# Altium schematic sheet JTAG批量下载板-V06.SchDoc
size A2
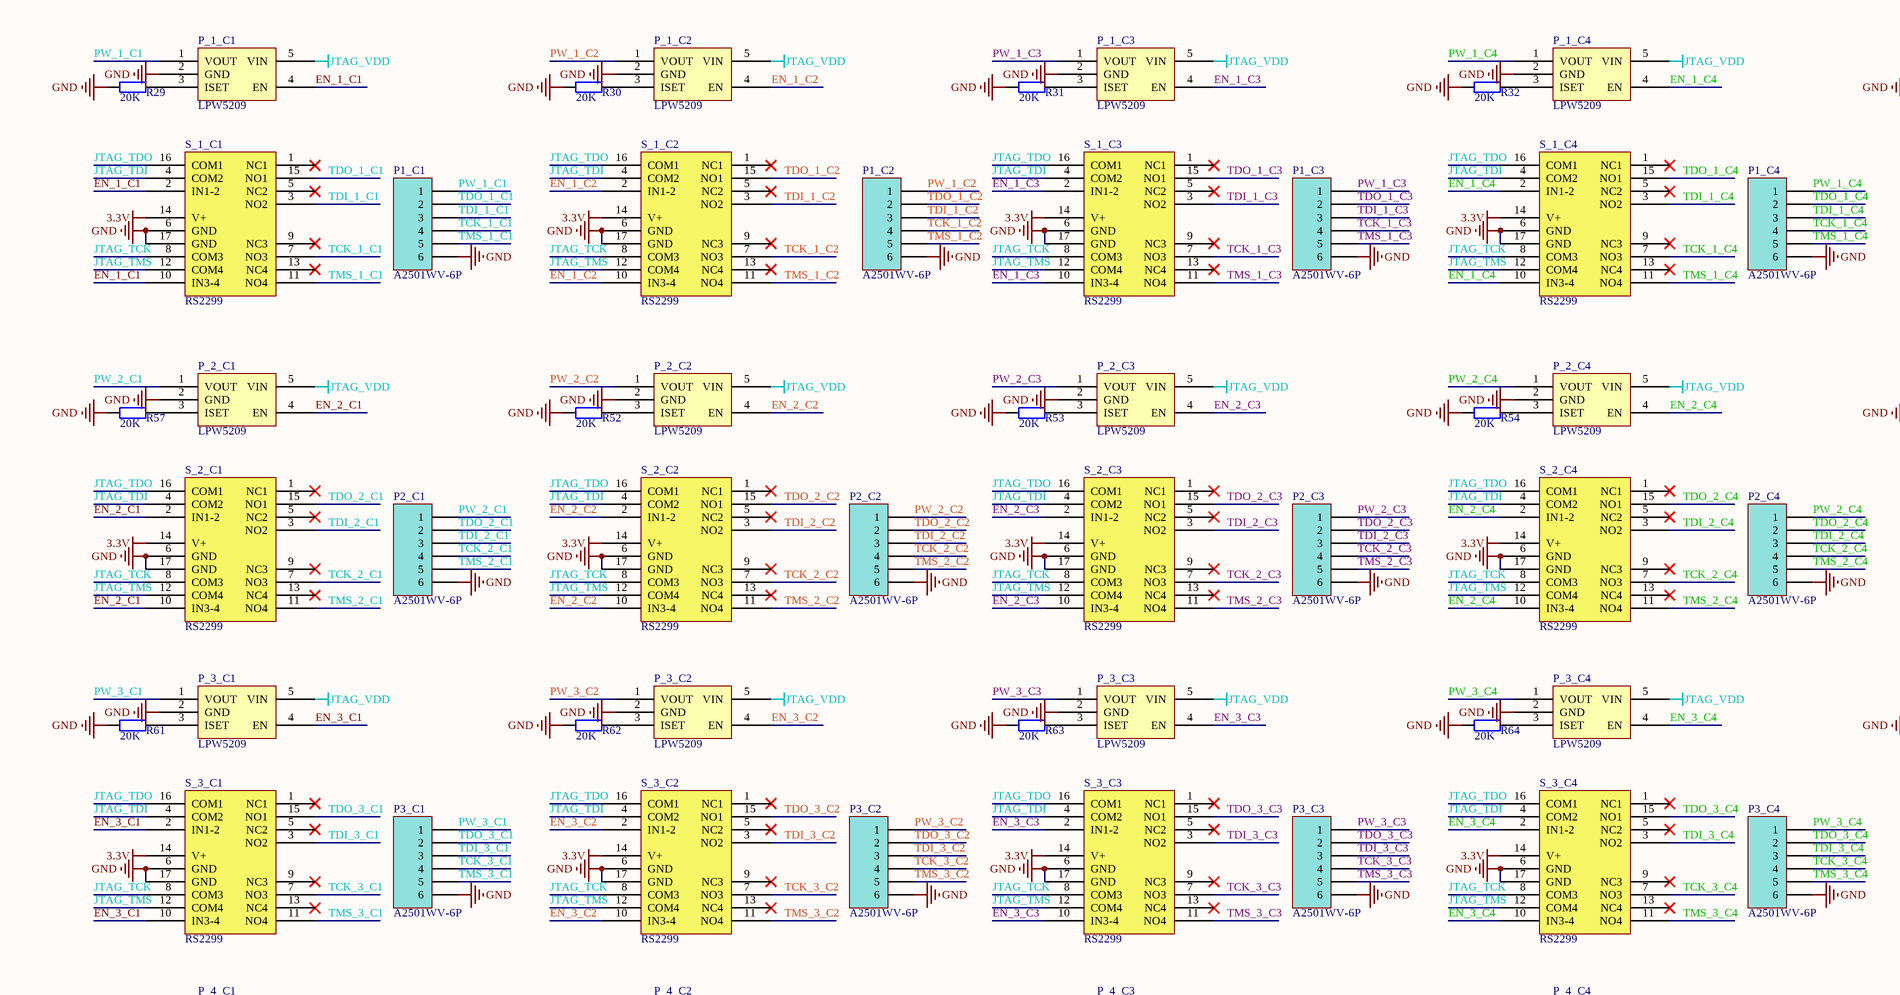
[diagram p0: JTAG批量下载板-V06.SchDoc, top left]
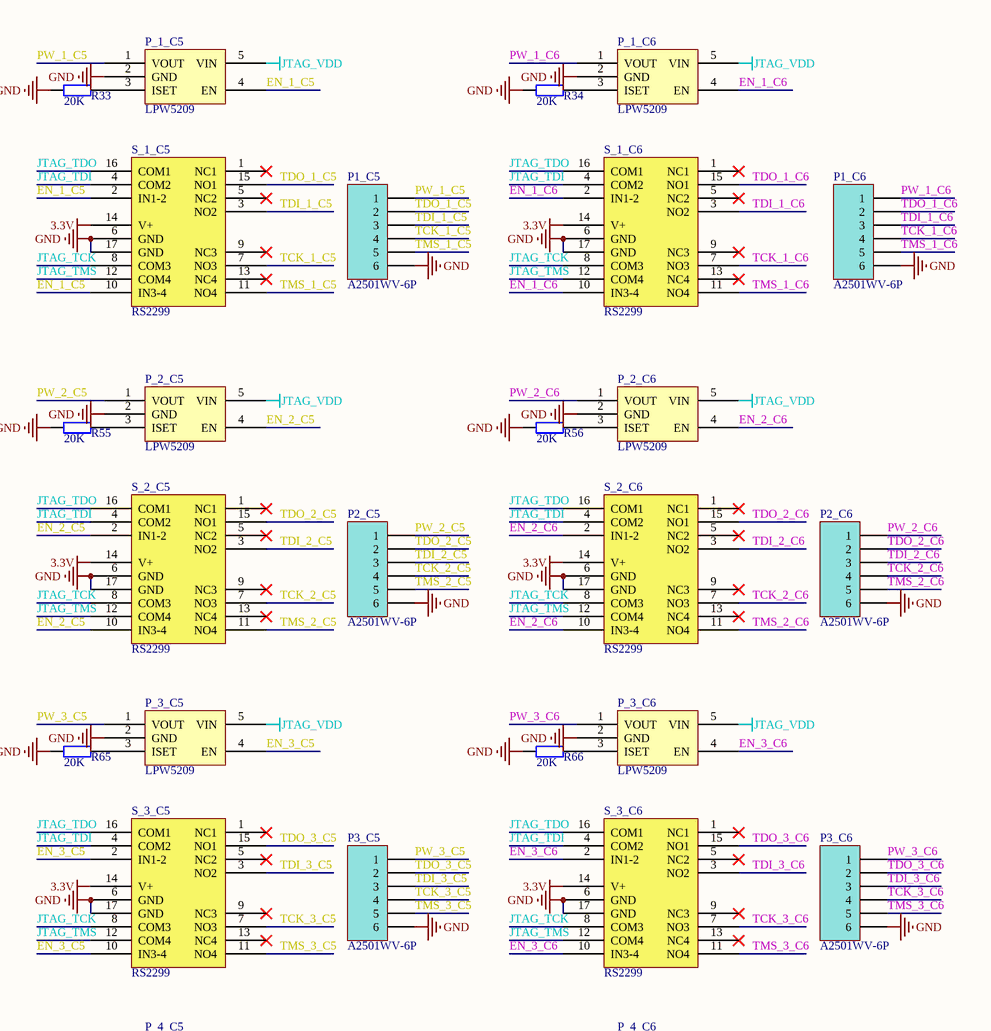
[diagram p1: JTAG批量下载板-V06.SchDoc, top right]
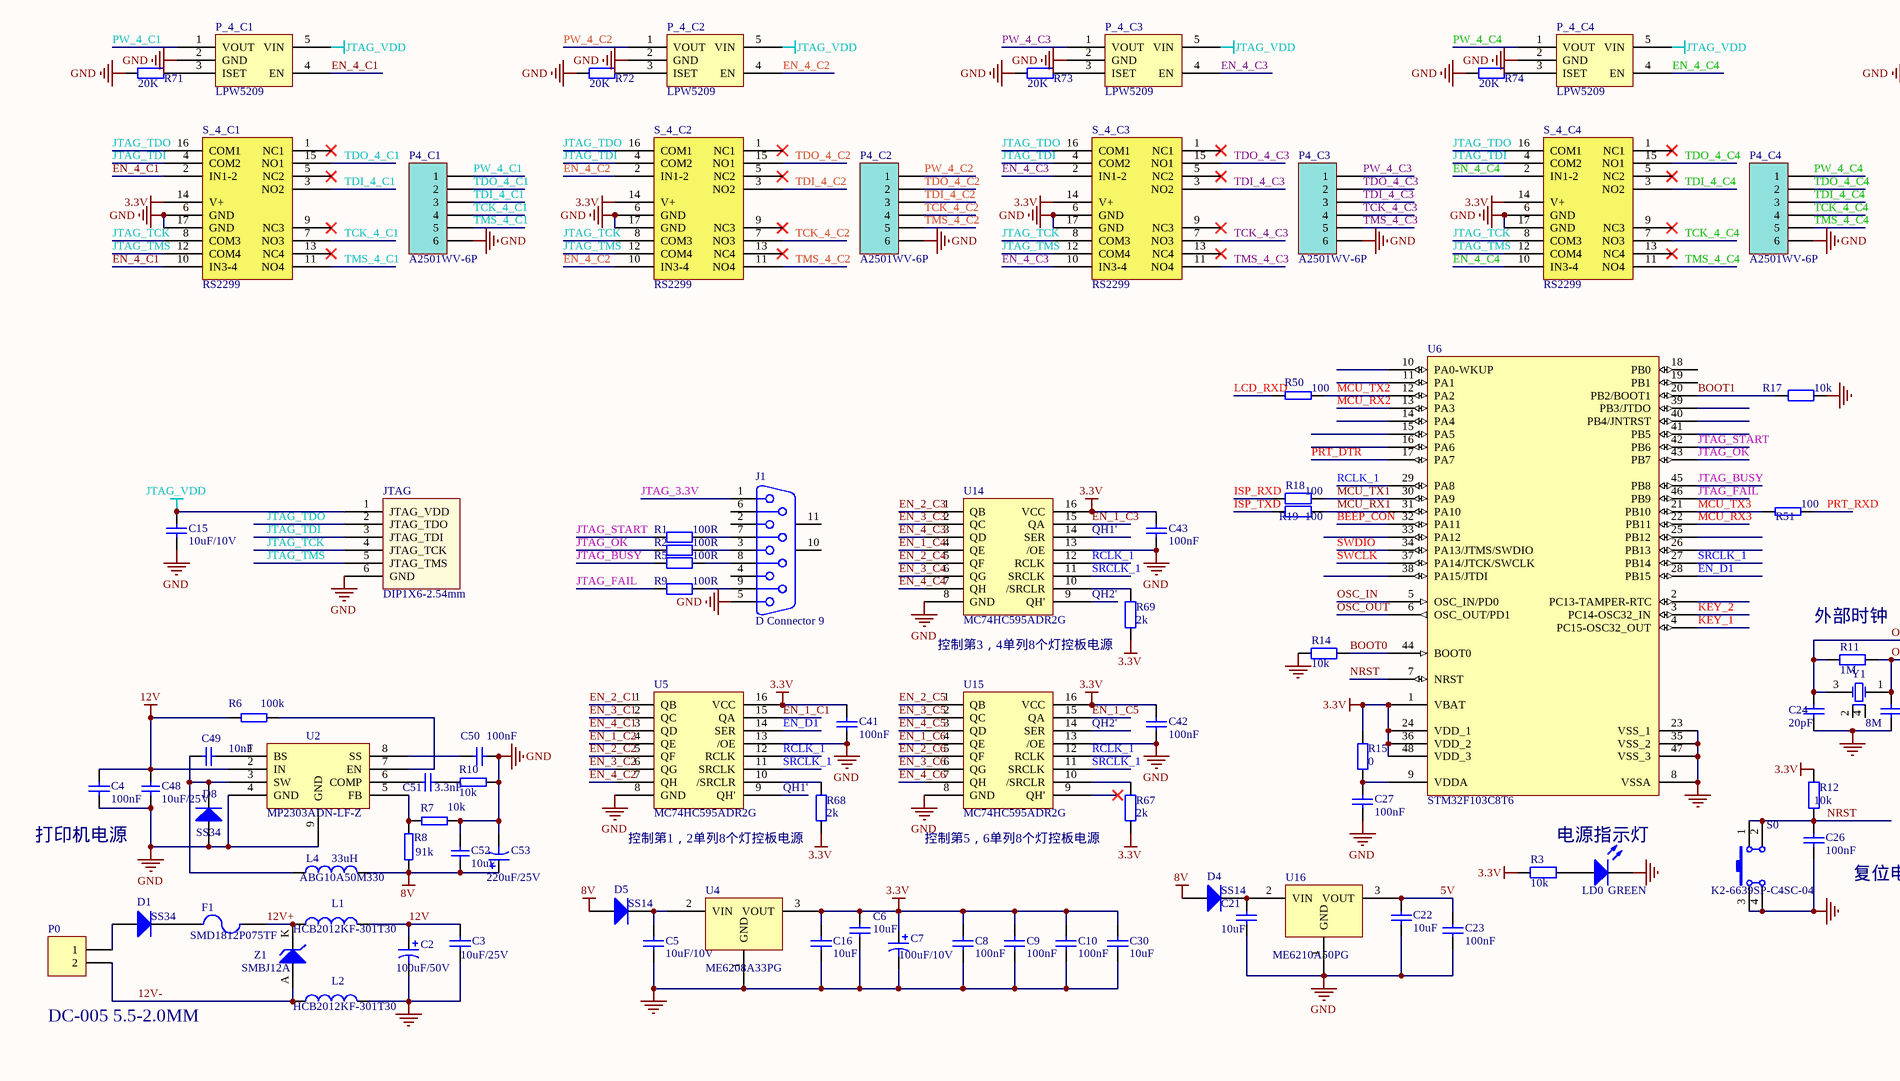
[diagram p2: JTAG批量下载板-V06.SchDoc, bottom left]
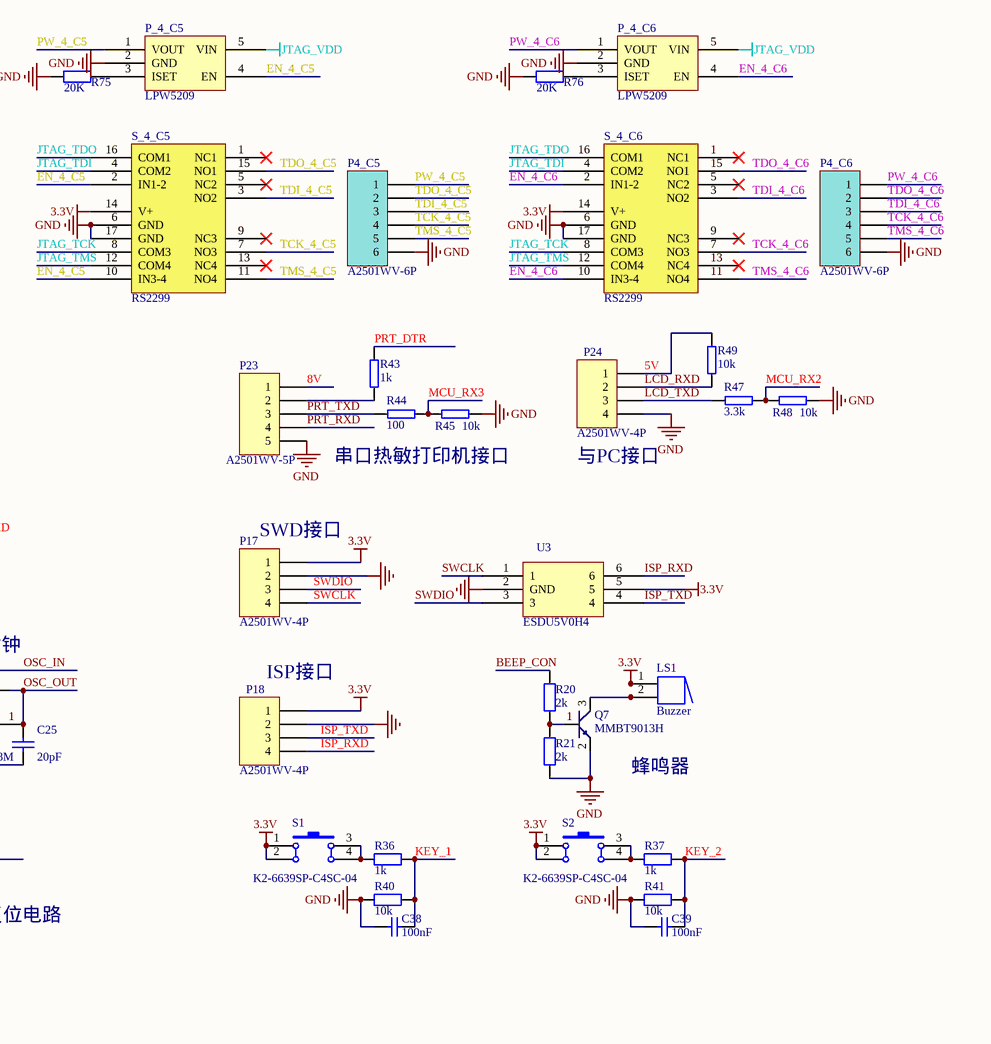
[diagram p3: JTAG批量下载板-V06.SchDoc, bottom right]

## Parts
C2  100uF/50V  [RB-6*9]
C3  10uF/25V  [C0805]
C4  100nF  [C0603]
C5  10uF/10V  [C0603]
C6  10uF  [C0603]
C7  100uF/10V  [C3528]
C8  100nF  [C0603]
C9  100nF  [C0603]
C10  100nF  [C0603]
C15  10uF/10V  [C0603]
C16  10uF  [C0603]
C21  10uF  [C0603]
C22  10uF  [C0603]
C23  100nF  [C0603]
C24  20pF  [C0603]
C25  20pF  [C0603]
C26  100nF  [C0603]
C27  100nF  [C0603]
C30  10uF  [C0603]
C38  100nF  [C0603]
C39  100nF  [C0603]
C41  100nF  [C0603]
C42  100nF  [C0603]
C43  100nF  [C0603]
C48  10uF/25V  [C0805]
C49  10nF  [C0603]
C50  100nF  [C0603]
C51  3.3nF  [C0603]
C52  10uF  [C0603]
C53  220uF/25V  [RB-6*9]
D1  SS34  [SMB]
D4  SS14  [SOD-123F]
D5  SS14  [SOD-123F]
D8  SS34  [SMB]
F1  SMD1812P075TF  [1812]
J1  D Connector 9  [DSUB1.385-2H9]
JTAG  DIP1X6-2.54mm  [XH2.5-6P]
L1  HCB2012KF-301T30  [R0805]
L2  HCB2012KF-301T30  [R0805]
L4  33uH  value ABG10A50M330  [L1040]
LD0  GREEN  [LED-0603]
LS1  Buzzer  [BUZZER-small]
P0  DC-005 5.5-2.0MM  [DC-005A]
P1_C1  A2501WV-6P  [XH2.5-6P]
P1_C2  A2501WV-6P  [XH2.5-6P]
P1_C3  A2501WV-6P  [XH2.5-6P]
P1_C4  A2501WV-6P  [XH2.5-6P]
P1_C5  A2501WV-6P  [XH2.5-6P]
P1_C6  A2501WV-6P  [XH2.5-6P]
P2_C1  A2501WV-6P  [XH2.5-6P]
P2_C2  A2501WV-6P  [XH2.5-6P]
P2_C3  A2501WV-6P  [XH2.5-6P]
P2_C4  A2501WV-6P  [XH2.5-6P]
P2_C5  A2501WV-6P  [XH2.5-6P]
P2_C6  A2501WV-6P  [XH2.5-6P]
P3_C1  A2501WV-6P  [XH2.5-6P]
P3_C2  A2501WV-6P  [XH2.5-6P]
P3_C3  A2501WV-6P  [XH2.5-6P]
P3_C4  A2501WV-6P  [XH2.5-6P]
P3_C5  A2501WV-6P  [XH2.5-6P]
P3_C6  A2501WV-6P  [XH2.5-6P]
P4_C1  A2501WV-6P  [XH2.5-6P]
P4_C2  A2501WV-6P  [XH2.5-6P]
P4_C3  A2501WV-6P  [XH2.5-6P]
P4_C4  A2501WV-6P  [XH2.5-6P]
P4_C5  A2501WV-6P  [XH2.5-6P]
P4_C6  A2501WV-6P  [XH2.5-6P]
P17  A2501WV-4P  [XH2.5-4P]
P18  A2501WV-4P  [XH2.5-4P]
P23  A2501WV-5P  [XH2.5-5P]
P24  A2501WV-4P  [XH2.5-4P]
P_1_C1  LPW5209  [SOT-23-5]
P_1_C2  LPW5209  [SOT-23-5]
P_1_C3  LPW5209  [SOT-23-5]
P_1_C4  LPW5209  [SOT-23-5]
P_1_C5  LPW5209  [SOT-23-5]
P_1_C6  LPW5209  [SOT-23-5]
P_2_C1  LPW5209  [SOT-23-5]
P_2_C2  LPW5209  [SOT-23-5]
P_2_C3  LPW5209  [SOT-23-5]
P_2_C4  LPW5209  [SOT-23-5]
P_2_C5  LPW5209  [SOT-23-5]
P_2_C6  LPW5209  [SOT-23-5]
P_3_C1  LPW5209  [SOT-23-5]
P_3_C2  LPW5209  [SOT-23-5]
P_3_C3  LPW5209  [SOT-23-5]
P_3_C4  LPW5209  [SOT-23-5]
P_3_C5  LPW5209  [SOT-23-5]
P_3_C6  LPW5209  [SOT-23-5]
P_4_C1  LPW5209  [SOT-23-5]
P_4_C2  LPW5209  [SOT-23-5]
P_4_C3  LPW5209  [SOT-23-5]
P_4_C4  LPW5209  [SOT-23-5]
P_4_C5  LPW5209  [SOT-23-5]
P_4_C6  LPW5209  [SOT-23-5]
Q7  MMBT9013H  [SOT-23]
R1  100R  [R0603]
R2  100R  [R0603]
R3  10k  [R0603]
R5  100R  [R0603]
R6  100k  [R0603]
R7  10k  [R0603]
R8  91k  [R0603]
R9  100R  [R0603]
R10  10k  [R0603]
R11  1M  [R0603]
R12  10k  [R0603]
R14  10k  [R0603]
R15  0  [R0603]
R17  10k  [R0603]
R18  100  [R0603]
R19  100  [R0603]
R20  2k  [R0603]
R21  2k  [R0603]
R29  20K  [R0603]
R30  20K  [R0603]
R31  20K  [R0603]
R32  20K  [R0603]
R33  20K  [R0603]
R34  20K  [R0603]
R36  1k  [R0603]
R37  1k  [R0603]
R40  10k  [R0603]
R41  10k  [R0603]
R43  1k  [R0603]
R44  100  [R0603]
R45  10k  [R0603]
R47  3.3k  [R0603]
R48  10k  [R0603]
R49  10k  [R0603]
R50  100  [R0603]
R51  100  [R0603]
R52  20K  [R0603]
R53  20K  [R0603]
R54  20K  [R0603]
R55  20K  [R0603]
R56  20K  [R0603]
R57  20K  [R0603]
R61  20K  [R0603]
R62  20K  [R0603]
R63  20K  [R0603]
R64  20K  [R0603]
R65  20K  [R0603]
R66  20K  [R0603]
R67  2k  [R0603]
R68  2k  [R0603]
R69  2k  [R0603]
R71  20K  [R0603]
R72  20K  [R0603]
R73  20K  [R0603]
R74  20K  [R0603]
R75  20K  [R0603]
R76  20K  [R0603]
S0  K2-6639SP-C4SC-04  [MY_KEYSOP4]
S1  K2-6639SP-C4SC-04  [MY_KEYSOP4]
S2  K2-6639SP-C4SC-04  [MY_KEYSOP4]
S_1_C1  RS2299  [QFN16]
S_1_C2  RS2299  [QFN16]
S_1_C3  RS2299  [QFN16]
S_1_C4  RS2299  [QFN16]
S_1_C5  RS2299  [QFN16]
S_1_C6  RS2299  [QFN16]
S_2_C1  RS2299  [QFN16]
S_2_C2  RS2299  [QFN16]
S_2_C3  RS2299  [QFN16]
S_2_C4  RS2299  [QFN16]
S_2_C5  RS2299  [QFN16]
S_2_C6  RS2299  [QFN16]
S_3_C1  RS2299  [QFN16]
S_3_C2  RS2299  [QFN16]
S_3_C3  RS2299  [QFN16]
S_3_C4  RS2299  [QFN16]
S_3_C5  RS2299  [QFN16]
S_3_C6  RS2299  [QFN16]
S_4_C1  RS2299  [QFN16]
S_4_C2  RS2299  [QFN16]
S_4_C3  RS2299  [QFN16]
S_4_C4  RS2299  [QFN16]
S_4_C5  RS2299  [QFN16]
S_4_C6  RS2299  [QFN16]
U2  MP2303ADN-LF-Z  [SO-8-EP]
U3  ESDU5V0H4  [SOT-23-6]
U4  ME6208A33PG  [SOT89N]
U5  MC74HC595ADR2G  [SOP16_M]
U6  STM32F103C8T6  [LQFP-48-1]
U14  MC74HC595ADR2G  [SOP16_M]
U15  MC74HC595ADR2G  [SOP16_M]
U16  ME6210A50PG  [SOT89N]
Y1  8M  [CRYSTAL_3.2*2.5]
Z1  SMBJ12A  [SMB]

## Nets
3.3V: C6.1 C7.1 C8.1 C9.1 C10.1 C16.1 C30.1 C41.1 C42.1 C43.1 LS1.1 P17.1 P18.1 R3.1 R12.2 R15.2 R67.1 R68.1 R69.1 S1.1 S1.2 S2.1 S2.2 S_1_C1.14(V+) S_1_C2.14(V+) S_1_C3.14(V+) S_1_C4.14(V+) S_1_C5.14(V+) S_1_C6.14(V+) S_2_C1.14(V+) S_2_C2.14(V+) S_2_C3.14(V+) S_2_C4.14(V+) S_2_C5.14(V+) S_2_C6.14(V+) S_3_C1.14(V+) S_3_C2.14(V+) S_3_C3.14(V+) S_3_C4.14(V+) S_3_C5.14(V+) S_3_C6.14(V+) S_4_C1.14(V+) S_4_C2.14(V+) S_4_C3.14(V+) S_4_C4.14(V+) S_4_C5.14(V+) S_4_C6.14(V+) U3.5 U4.3(VOUT) U5.16(VCC) U6.1(VBAT) U6.24(VDD_1) U6.36(VDD_2) U6.48(VDD_3) U14.16(VCC) U15.16(VCC)
8V: C52.1 C53.1 D4.1(A) D5.1(A) L4.2 P23.1 R8.2
12V: C2.1 C3.1 C4.1 C48.1 L1.1 R6.2 U2.2(IN)
GND: C2.2 C3.2 C4.2 C5.2 C6.2 C7.2 C8.2 C9.2 C10.2 C15.2 C16.2 C21.2 C22.2 C23.1 C24.2 C25.2 C26.2 C27.2 C30.2 C38.1 C39.1 C41.2 C42.2 C43.2 C48.2 C50.2 C52.2 C53.2 D8.1(A) J1.5 JTAG.6(GND) L2.1 LD0.2(K) P1_C1.6 P1_C2.6 P1_C3.6 P1_C4.6 P1_C5.6 P1_C6.6 P2_C1.6 P2_C2.6 P2_C3.6 P2_C4.6 P2_C5.6 P2_C6.6 P3_C1.6 P3_C2.6 P3_C3.6 P3_C4.6 P3_C5.6 P3_C6.6 P4_C1.6 P4_C2.6 P4_C3.6 P4_C4.6 P4_C5.6 P4_C6.6 P17.2 P18.2 P23.5 P24.4 P_1_C1.2(GND) P_1_C2.2(GND) P_1_C3.2(GND) P_1_C4.2(GND) P_1_C5.2(GND) P_1_C6.2(GND) P_2_C1.2(GND) P_2_C2.2(GND) P_2_C3.2(GND) P_2_C4.2(GND) P_2_C5.2(GND) P_2_C6.2(GND) P_3_C1.2(GND) P_3_C2.2(GND) P_3_C3.2(GND) P_3_C4.2(GND) P_3_C5.2(GND) P_3_C6.2(GND) P_4_C1.2(GND) P_4_C2.2(GND) P_4_C3.2(GND) P_4_C4.2(GND) P_4_C5.2(GND) P_4_C6.2(GND) Q7.2(E) R7.1 R10.1 R14.1 R17.1 R21.1 R29.2 R30.2 R31.2 R32.2 R33.2 R34.2 R40.2 R41.2 R45.1 R48.1 R52.2 R53.2 R54.2 R55.2 R56.2 R57.2 R61.2 R62.2 R63.2 R64.2 R65.2 R66.2 R71.2 R72.2 R73.2 R74.2 R75.2 R76.2 S0.3 S0.4 S_1_C1.6(GND) S_1_C1.17(GND) S_1_C2.6(GND) S_1_C2.17(GND) S_1_C3.6(GND) S_1_C3.17(GND) S_1_C4.6(GND) S_1_C4.17(GND) S_1_C5.6(GND) S_1_C5.17(GND) S_1_C6.6(GND) S_1_C6.17(GND) S_2_C1.6(GND) S_2_C1.17(GND) S_2_C2.6(GND) S_2_C2.17(GND) S_2_C3.6(GND) S_2_C3.17(GND) S_2_C4.6(GND) S_2_C4.17(GND) S_2_C5.6(GND) S_2_C5.17(GND) S_2_C6.6(GND) S_2_C6.17(GND) S_3_C1.6(GND) S_3_C1.17(GND) S_3_C2.6(GND) S_3_C2.17(GND) S_3_C3.6(GND) S_3_C3.17(GND) S_3_C4.6(GND) S_3_C4.17(GND) S_3_C5.6(GND) S_3_C5.17(GND) S_3_C6.6(GND) S_3_C6.17(GND) S_4_C1.6(GND) S_4_C1.17(GND) S_4_C2.6(GND) S_4_C2.17(GND) S_4_C3.6(GND) S_4_C3.17(GND) S_4_C4.6(GND) S_4_C4.17(GND) S_4_C5.6(GND) S_4_C5.17(GND) S_4_C6.6(GND) S_4_C6.17(GND) U2.4(GND) U2.9(GND) U3.2(GND) U4.1(GND) U5.8(GND) U5.13(/OE) U6.8(VSSA) U6.23(VSS_1) U6.35(VSS_2) U6.47(VSS_3) U14.8(GND) U14.13(/OE) U15.8(GND) U15.13(/OE) U16.1(GND)
JTAG_VDD: C15.1 JTAG.1(JTAG_VDD) P_1_C1.5(VIN) P_1_C2.5(VIN) P_1_C3.5(VIN) P_1_C4.5(VIN) P_1_C5.5(VIN) P_1_C6.5(VIN) P_2_C1.5(VIN) P_2_C2.5(VIN) P_2_C3.5(VIN) P_2_C4.5(VIN) P_2_C5.5(VIN) P_2_C6.5(VIN) P_3_C1.5(VIN) P_3_C2.5(VIN) P_3_C3.5(VIN) P_3_C4.5(VIN) P_3_C5.5(VIN) P_3_C6.5(VIN) P_4_C1.5(VIN) P_4_C2.5(VIN) P_4_C3.5(VIN) P_4_C4.5(VIN) P_4_C5.5(VIN) P_4_C6.5(VIN)
5V: C22.1 C23.2 P24.1 R49.2 U16.3(VOUT)
12V+: F1.2 L1.2 Z1.K
12V-: L2.2 P0.2 Z1.A
BEEP_CON: R20.1 U6.32(PA11)
BOOT0: R14.2 U6.44(BOOT0)
BOOT1: R17.2 U6.20(PB2/BOOT1)
EN_1_C1: P_1_C1.4(EN) S_1_C1.2(IN1-2) S_1_C1.10(IN3-4) U5.15(QA)
EN_1_C2: P_1_C2.4(EN) S_1_C2.2(IN1-2) S_1_C2.10(IN3-4) U5.4(QE)
EN_1_C3: P_1_C3.4(EN) S_1_C3.2(IN1-2) S_1_C3.10(IN3-4) U14.15(QA)
EN_1_C4: P_1_C4.4(EN) S_1_C4.2(IN1-2) S_1_C4.10(IN3-4) U14.4(QE)
EN_1_C5: P_1_C5.4(EN) S_1_C5.2(IN1-2) S_1_C5.10(IN3-4) U15.15(QA)
EN_1_C6: P_1_C6.4(EN) S_1_C6.2(IN1-2) S_1_C6.10(IN3-4) U15.4(QE)
EN_2_C1: P_2_C1.4(EN) S_2_C1.2(IN1-2) S_2_C1.10(IN3-4) U5.1(QB)
EN_2_C2: P_2_C2.4(EN) S_2_C2.2(IN1-2) S_2_C2.10(IN3-4) U5.5(QF)
EN_2_C3: P_2_C3.4(EN) S_2_C3.2(IN1-2) S_2_C3.10(IN3-4) U14.1(QB)
EN_2_C4: P_2_C4.4(EN) S_2_C4.2(IN1-2) S_2_C4.10(IN3-4) U14.5(QF)
EN_2_C5: P_2_C5.4(EN) S_2_C5.2(IN1-2) S_2_C5.10(IN3-4) U15.1(QB)
EN_2_C6: P_2_C6.4(EN) S_2_C6.2(IN1-2) S_2_C6.10(IN3-4) U15.5(QF)
EN_3_C1: P_3_C1.4(EN) S_3_C1.2(IN1-2) S_3_C1.10(IN3-4) U5.2(QC)
EN_3_C2: P_3_C2.4(EN) S_3_C2.2(IN1-2) S_3_C2.10(IN3-4) U5.6(QG)
EN_3_C3: P_3_C3.4(EN) S_3_C3.2(IN1-2) S_3_C3.10(IN3-4) U14.2(QC)
EN_3_C4: P_3_C4.4(EN) S_3_C4.2(IN1-2) S_3_C4.10(IN3-4) U14.6(QG)
EN_3_C5: P_3_C5.4(EN) S_3_C5.2(IN1-2) S_3_C5.10(IN3-4) U15.2(QC)
EN_3_C6: P_3_C6.4(EN) S_3_C6.2(IN1-2) S_3_C6.10(IN3-4) U15.6(QG)
EN_4_C1: P_4_C1.4(EN) S_4_C1.2(IN1-2) S_4_C1.10(IN3-4) U5.3(QD)
EN_4_C2: P_4_C2.4(EN) S_4_C2.2(IN1-2) S_4_C2.10(IN3-4) U5.7(QH)
EN_4_C3: P_4_C3.4(EN) S_4_C3.2(IN1-2) S_4_C3.10(IN3-4) U14.3(QD)
EN_4_C4: P_4_C4.4(EN) S_4_C4.2(IN1-2) S_4_C4.10(IN3-4) U14.7(QH)
EN_4_C5: P_4_C5.4(EN) S_4_C5.2(IN1-2) S_4_C5.10(IN3-4) U15.3(QD)
EN_4_C6: P_4_C6.4(EN) S_4_C6.2(IN1-2) S_4_C6.10(IN3-4) U15.7(QH)
EN_D1: U5.14(SER) U6.28(PB15)
ISP_RXD: P18.4 R18.1 U3.6
ISP_TXD: P18.3 R19.1 U3.4
JTAG_3.3V: J1.1
JTAG_BUSY: R5.2 U6.45(PB8)
JTAG_FAIL: R9.2 U6.46(PB9)
JTAG_OK: R2.2 U6.43(PB7)
JTAG_START: R1.2 U6.42(PB6)
JTAG_TCK: JTAG.4(JTAG_TCK) S_1_C1.8(COM3) S_1_C2.8(COM3) S_1_C3.8(COM3) S_1_C4.8(COM3) S_1_C5.8(COM3) S_1_C6.8(COM3) S_2_C1.8(COM3) S_2_C2.8(COM3) S_2_C3.8(COM3) S_2_C4.8(COM3) S_2_C5.8(COM3) S_2_C6.8(COM3) S_3_C1.8(COM3) S_3_C2.8(COM3) S_3_C3.8(COM3) S_3_C4.8(COM3) S_3_C5.8(COM3) S_3_C6.8(COM3) S_4_C1.8(COM3) S_4_C2.8(COM3) S_4_C3.8(COM3) S_4_C4.8(COM3) S_4_C5.8(COM3) S_4_C6.8(COM3)
JTAG_TDI: JTAG.3(JTAG_TDI) S_1_C1.4(COM2) S_1_C2.4(COM2) S_1_C3.4(COM2) S_1_C4.4(COM2) S_1_C5.4(COM2) S_1_C6.4(COM2) S_2_C1.4(COM2) S_2_C2.4(COM2) S_2_C3.4(COM2) S_2_C4.4(COM2) S_2_C5.4(COM2) S_2_C6.4(COM2) S_3_C1.4(COM2) S_3_C2.4(COM2) S_3_C3.4(COM2) S_3_C4.4(COM2) S_3_C5.4(COM2) S_3_C6.4(COM2) S_4_C1.4(COM2) S_4_C2.4(COM2) S_4_C3.4(COM2) S_4_C4.4(COM2) S_4_C5.4(COM2) S_4_C6.4(COM2)
JTAG_TDO: JTAG.2(JTAG_TDO) S_1_C1.16(COM1) S_1_C2.16(COM1) S_1_C3.16(COM1) S_1_C4.16(COM1) S_1_C5.16(COM1) S_1_C6.16(COM1) S_2_C1.16(COM1) S_2_C2.16(COM1) S_2_C3.16(COM1) S_2_C4.16(COM1) S_2_C5.16(COM1) S_2_C6.16(COM1) S_3_C1.16(COM1) S_3_C2.16(COM1) S_3_C3.16(COM1) S_3_C4.16(COM1) S_3_C5.16(COM1) S_3_C6.16(COM1) S_4_C1.16(COM1) S_4_C2.16(COM1) S_4_C3.16(COM1) S_4_C4.16(COM1) S_4_C5.16(COM1) S_4_C6.16(COM1)
JTAG_TMS: JTAG.5(JTAG_TMS) S_1_C1.12(COM4) S_1_C2.12(COM4) S_1_C3.12(COM4) S_1_C4.12(COM4) S_1_C5.12(COM4) S_1_C6.12(COM4) S_2_C1.12(COM4) S_2_C2.12(COM4) S_2_C3.12(COM4) S_2_C4.12(COM4) S_2_C5.12(COM4) S_2_C6.12(COM4) S_3_C1.12(COM4) S_3_C2.12(COM4) S_3_C3.12(COM4) S_3_C4.12(COM4) S_3_C5.12(COM4) S_3_C6.12(COM4) S_4_C1.12(COM4) S_4_C2.12(COM4) S_4_C3.12(COM4) S_4_C4.12(COM4) S_4_C5.12(COM4) S_4_C6.12(COM4)
KEY_1: C38.2 R36.1 R40.1 U6.4(PC15-OSC32_OUT)
KEY_2: C39.2 R37.1 R41.1 U6.3(PC14-OSC32_IN)
LCD_RXD: P24.2 R49.1 R50.1
LCD_TXD: P24.3 R47.1
MCU_RX1: R19.2 U6.31(PA10)
MCU_RX2: R47.2 R48.2 U6.13(PA3)
MCU_RX3: R44.2 R45.2 U6.22(PB11)
MCU_TX1: R18.2 U6.30(PA9)
MCU_TX2: R50.2 U6.12(PA2)
MCU_TX3: R51.2 U6.21(PB10)
NRST: C26.1 R12.1 S0.1 S0.2 U6.7(NRST)
OSC_IN: C24.1 R11.1 U6.5(OSC_IN/PD0) Y1.3(OUTPUT)
OSC_OUT: C25.1 R11.2 U6.6(OSC_OUT/PD1) Y1.1(INPUT)
PRT_DTR: R43.2 U6.17(PA7)
PRT_RXD: P23.4 R51.1
PRT_TXD: P23.3 R44.1
PW_1_C1: P1_C1.1 P_1_C1.1(VOUT)
PW_1_C2: P1_C2.1 P_1_C2.1(VOUT)
PW_1_C3: P1_C3.1 P_1_C3.1(VOUT)
PW_1_C4: P1_C4.1 P_1_C4.1(VOUT)
PW_1_C5: P1_C5.1 P_1_C5.1(VOUT)
PW_1_C6: P1_C6.1 P_1_C6.1(VOUT)
PW_2_C1: P2_C1.1 P_2_C1.1(VOUT)
PW_2_C2: P2_C2.1 P_2_C2.1(VOUT)
PW_2_C3: P2_C3.1 P_2_C3.1(VOUT)
PW_2_C4: P2_C4.1 P_2_C4.1(VOUT)
PW_2_C5: P2_C5.1 P_2_C5.1(VOUT)
PW_2_C6: P2_C6.1 P_2_C6.1(VOUT)
PW_3_C1: P3_C1.1 P_3_C1.1(VOUT)
PW_3_C2: P3_C2.1 P_3_C2.1(VOUT)
PW_3_C3: P3_C3.1 P_3_C3.1(VOUT)
PW_3_C4: P3_C4.1 P_3_C4.1(VOUT)
PW_3_C5: P3_C5.1 P_3_C5.1(VOUT)
PW_3_C6: P3_C6.1 P_3_C6.1(VOUT)
PW_4_C1: P4_C1.1 P_4_C1.1(VOUT)
PW_4_C2: P4_C2.1 P_4_C2.1(VOUT)
PW_4_C3: P4_C3.1 P_4_C3.1(VOUT)
PW_4_C4: P4_C4.1 P_4_C4.1(VOUT)
PW_4_C5: P4_C5.1 P_4_C5.1(VOUT)
PW_4_C6: P4_C6.1 P_4_C6.1(VOUT)
QH1': U5.9(QH') U14.14(SER)
QH2': U14.9(QH') U15.14(SER)
RCLK_1: U5.12(RCLK) U6.29(PA8) U14.12(RCLK) U15.12(RCLK)
SRCLK_1: U5.11(SRCLK) U6.27(PB14) U14.11(SRCLK) U15.11(SRCLK)
SWCLK: P17.4 U3.1 U6.37(PA14/JTCK/SWCLK)
SWDIO: P17.3 U3.3 U6.34(PA13/JTMS/SWDIO)
TCK_1_C1: P1_C1.4 S_1_C1.7(NO3)
TCK_1_C2: P1_C2.4 S_1_C2.7(NO3)
TCK_1_C3: P1_C3.4 S_1_C3.7(NO3)
TCK_1_C4: P1_C4.4 S_1_C4.7(NO3)
TCK_1_C5: P1_C5.4 S_1_C5.7(NO3)
TCK_1_C6: P1_C6.4 S_1_C6.7(NO3)
TCK_2_C1: P2_C1.4 S_2_C1.7(NO3)
TCK_2_C2: P2_C2.4 S_2_C2.7(NO3)
TCK_2_C3: P2_C3.4 S_2_C3.7(NO3)
TCK_2_C4: P2_C4.4 S_2_C4.7(NO3)
TCK_2_C5: P2_C5.4 S_2_C5.7(NO3)
TCK_2_C6: P2_C6.4 S_2_C6.7(NO3)
TCK_3_C1: P3_C1.4 S_3_C1.7(NO3)
TCK_3_C2: P3_C2.4 S_3_C2.7(NO3)
TCK_3_C3: P3_C3.4 S_3_C3.7(NO3)
TCK_3_C4: P3_C4.4 S_3_C4.7(NO3)
TCK_3_C5: P3_C5.4 S_3_C5.7(NO3)
TCK_3_C6: P3_C6.4 S_3_C6.7(NO3)
TCK_4_C1: P4_C1.4 S_4_C1.7(NO3)
TCK_4_C2: P4_C2.4 S_4_C2.7(NO3)
TCK_4_C3: P4_C3.4 S_4_C3.7(NO3)
TCK_4_C4: P4_C4.4 S_4_C4.7(NO3)
TCK_4_C5: P4_C5.4 S_4_C5.7(NO3)
TCK_4_C6: P4_C6.4 S_4_C6.7(NO3)
TDI_1_C1: P1_C1.3 S_1_C1.3(NO2)
TDI_1_C2: P1_C2.3 S_1_C2.3(NO2)
TDI_1_C3: P1_C3.3 S_1_C3.3(NO2)
TDI_1_C4: P1_C4.3 S_1_C4.3(NO2)
TDI_1_C5: P1_C5.3 S_1_C5.3(NO2)
TDI_1_C6: P1_C6.3 S_1_C6.3(NO2)
TDI_2_C1: P2_C1.3 S_2_C1.3(NO2)
TDI_2_C2: P2_C2.3 S_2_C2.3(NO2)
TDI_2_C3: P2_C3.3 S_2_C3.3(NO2)
TDI_2_C4: P2_C4.3 S_2_C4.3(NO2)
TDI_2_C5: P2_C5.3 S_2_C5.3(NO2)
TDI_2_C6: P2_C6.3 S_2_C6.3(NO2)
TDI_3_C1: P3_C1.3 S_3_C1.3(NO2)
TDI_3_C2: P3_C2.3 S_3_C2.3(NO2)
TDI_3_C3: P3_C3.3 S_3_C3.3(NO2)
TDI_3_C4: P3_C4.3 S_3_C4.3(NO2)
TDI_3_C5: P3_C5.3 S_3_C5.3(NO2)
TDI_3_C6: P3_C6.3 S_3_C6.3(NO2)
TDI_4_C1: P4_C1.3 S_4_C1.3(NO2)
TDI_4_C2: P4_C2.3 S_4_C2.3(NO2)
TDI_4_C3: P4_C3.3 S_4_C3.3(NO2)
TDI_4_C4: P4_C4.3 S_4_C4.3(NO2)
TDI_4_C5: P4_C5.3 S_4_C5.3(NO2)
TDI_4_C6: P4_C6.3 S_4_C6.3(NO2)
TDO_1_C1: P1_C1.2 S_1_C1.15(NO1)
TDO_1_C2: P1_C2.2 S_1_C2.15(NO1)
TDO_1_C3: P1_C3.2 S_1_C3.15(NO1)
TDO_1_C4: P1_C4.2 S_1_C4.15(NO1)
TDO_1_C5: P1_C5.2 S_1_C5.15(NO1)
TDO_1_C6: P1_C6.2 S_1_C6.15(NO1)
TDO_2_C1: P2_C1.2 S_2_C1.15(NO1)
TDO_2_C2: P2_C2.2 S_2_C2.15(NO1)
TDO_2_C3: P2_C3.2 S_2_C3.15(NO1)
TDO_2_C4: P2_C4.2 S_2_C4.15(NO1)
TDO_2_C5: P2_C5.2 S_2_C5.15(NO1)
TDO_2_C6: P2_C6.2 S_2_C6.15(NO1)
TDO_3_C1: P3_C1.2 S_3_C1.15(NO1)
TDO_3_C2: P3_C2.2 S_3_C2.15(NO1)
TDO_3_C3: P3_C3.2 S_3_C3.15(NO1)
TDO_3_C4: P3_C4.2 S_3_C4.15(NO1)
TDO_3_C5: P3_C5.2 S_3_C5.15(NO1)
TDO_3_C6: P3_C6.2 S_3_C6.15(NO1)
TDO_4_C1: P4_C1.2 S_4_C1.15(NO1)
TDO_4_C2: P4_C2.2 S_4_C2.15(NO1)
TDO_4_C3: P4_C3.2 S_4_C3.15(NO1)
TDO_4_C4: P4_C4.2 S_4_C4.15(NO1)
TDO_4_C5: P4_C5.2 S_4_C5.15(NO1)
TDO_4_C6: P4_C6.2 S_4_C6.15(NO1)
TMS_1_C1: P1_C1.5 S_1_C1.11(NO4)
TMS_1_C2: P1_C2.5 S_1_C2.11(NO4)
TMS_1_C3: P1_C3.5 S_1_C3.11(NO4)
TMS_1_C4: P1_C4.5 S_1_C4.11(NO4)
TMS_1_C5: P1_C5.5 S_1_C5.11(NO4)
TMS_1_C6: P1_C6.5 S_1_C6.11(NO4)
TMS_2_C1: P2_C1.5 S_2_C1.11(NO4)
TMS_2_C2: P2_C2.5 S_2_C2.11(NO4)
TMS_2_C3: P2_C3.5 S_2_C3.11(NO4)
TMS_2_C4: P2_C4.5 S_2_C4.11(NO4)
TMS_2_C5: P2_C5.5 S_2_C5.11(NO4)
TMS_2_C6: P2_C6.5 S_2_C6.11(NO4)
TMS_3_C1: P3_C1.5 S_3_C1.11(NO4)
TMS_3_C2: P3_C2.5 S_3_C2.11(NO4)
TMS_3_C3: P3_C3.5 S_3_C3.11(NO4)
TMS_3_C4: P3_C4.5 S_3_C4.11(NO4)
TMS_3_C5: P3_C5.5 S_3_C5.11(NO4)
TMS_3_C6: P3_C6.5 S_3_C6.11(NO4)
TMS_4_C1: P4_C1.5 S_4_C1.11(NO4)
TMS_4_C2: P4_C2.5 S_4_C2.11(NO4)
TMS_4_C3: P4_C3.5 S_4_C3.11(NO4)
TMS_4_C4: P4_C4.5 S_4_C4.11(NO4)
TMS_4_C5: P4_C5.5 S_4_C5.11(NO4)
TMS_4_C6: P4_C6.5 S_4_C6.11(NO4)
NetC5_1: C5.1 D5.2(K) U4.2(VIN)
NetC21_1: C21.1 D4.2(K) U16.2(VIN)
NetC27_1: C27.1 R15.1 U6.9(VDDA)
NetC49_1: C49.1 D8.2(K) L4.1 U2.3(SW)
NetC49_2: C49.2 U2.1(BS)
NetC50_1: C50.1 U2.8(SS)
NetC51_1: C51.1 U2.6(COMP)
NetC51_2: C51.2 R10.2
NetD1_1: D1.1(A) P0.1
NetD1_2: D1.2(K) F1.1
NetJ1_3: J1.3 R2.1
NetJ1_7: J1.7 R1.1
NetJ1_8: J1.8 R5.1
NetJ1_9: J1.9 R9.1
NetLD0_1: LD0.1(A) R3.2
NetLS1_2: LS1.2 Q7.3(C)
NetP23_2: P23.2 R43.1
NetP_1_C1_3: P_1_C1.3(ISET) R29.1
NetP_1_C2_3: P_1_C2.3(ISET) R30.1
NetP_1_C3_3: P_1_C3.3(ISET) R31.1
NetP_1_C4_3: P_1_C4.3(ISET) R32.1
NetP_1_C5_3: P_1_C5.3(ISET) R33.1
NetP_1_C6_3: P_1_C6.3(ISET) R34.1
NetP_2_C1_3: P_2_C1.3(ISET) R57.1
NetP_2_C2_3: P_2_C2.3(ISET) R52.1
NetP_2_C3_3: P_2_C3.3(ISET) R53.1
NetP_2_C4_3: P_2_C4.3(ISET) R54.1
NetP_2_C5_3: P_2_C5.3(ISET) R55.1
NetP_2_C6_3: P_2_C6.3(ISET) R56.1
NetP_3_C1_3: P_3_C1.3(ISET) R61.1
NetP_3_C2_3: P_3_C2.3(ISET) R62.1
NetP_3_C3_3: P_3_C3.3(ISET) R63.1
NetP_3_C4_3: P_3_C4.3(ISET) R64.1
NetP_3_C5_3: P_3_C5.3(ISET) R65.1
NetP_3_C6_3: P_3_C6.3(ISET) R66.1
NetP_4_C1_3: P_4_C1.3(ISET) R71.1
NetP_4_C2_3: P_4_C2.3(ISET) R72.1
NetP_4_C3_3: P_4_C3.3(ISET) R73.1
NetP_4_C4_3: P_4_C4.3(ISET) R74.1
NetP_4_C5_3: P_4_C5.3(ISET) R75.1
NetP_4_C6_3: P_4_C6.3(ISET) R76.1
NetQ7_1: Q7.1(B) R20.2 R21.2
NetR6_1: R6.1 U2.7(EN)
NetR7_2: R7.2 R8.1 U2.5(FB)
NetR36_2: R36.2 S1.3 S1.4
NetR37_2: R37.2 S2.3 S2.4
NetR67_2: R67.2 U15.10(/SRCLR)
NetR68_2: R68.2 U5.10(/SRCLR)
NetR69_2: R69.2 U14.10(/SRCLR)

Not connected (* = marked no-connect by the designer): J1 2 4 6 10(MH1) 11(MH2); S_1_C1 1(NC1)* 5(NC2)* 9(NC3)* 13(NC4)*; S_1_C2 1(NC1)* 5(NC2)* 9(NC3)* 13(NC4)*; S_1_C3 1(NC1)* 5(NC2)* 9(NC3)* 13(NC4)*; S_1_C4 1(NC1)* 5(NC2)* 9(NC3)* 13(NC4)*; S_1_C5 1(NC1)* 5(NC2)* 9(NC3)* 13(NC4)*; S_1_C6 1(NC1)* 5(NC2)* 9(NC3)* 13(NC4)*; S_2_C1 1(NC1)* 5(NC2)* 9(NC3)* 13(NC4)*; S_2_C2 1(NC1)* 5(NC2)* 9(NC3)* 13(NC4)*; S_2_C3 1(NC1)* 5(NC2)* 9(NC3)* 13(NC4)*; S_2_C4 1(NC1)* 5(NC2)* 9(NC3)* 13(NC4)*; S_2_C5 1(NC1)* 5(NC2)* 9(NC3)* 13(NC4)*; S_2_C6 1(NC1)* 5(NC2)* 9(NC3)* 13(NC4)*; S_3_C1 1(NC1)* 5(NC2)* 9(NC3)* 13(NC4)*; S_3_C2 1(NC1)* 5(NC2)* 9(NC3)* 13(NC4)*; S_3_C3 1(NC1)* 5(NC2)* 9(NC3)* 13(NC4)*; S_3_C4 1(NC1)* 5(NC2)* 9(NC3)* 13(NC4)*; S_3_C5 1(NC1)* 5(NC2)* 9(NC3)* 13(NC4)*; S_3_C6 1(NC1)* 5(NC2)* 9(NC3)* 13(NC4)*; S_4_C1 1(NC1)* 5(NC2)* 9(NC3)* 13(NC4)*; S_4_C2 1(NC1)* 5(NC2)* 9(NC3)* 13(NC4)*; S_4_C3 1(NC1)* 5(NC2)* 9(NC3)* 13(NC4)*; S_4_C4 1(NC1)* 5(NC2)* 9(NC3)* 13(NC4)*; S_4_C5 1(NC1)* 5(NC2)* 9(NC3)* 13(NC4)*; S_4_C6 1(NC1)* 5(NC2)* 9(NC3)* 13(NC4)*; U6 2(PC13-TAMPER-RTC) 10(PA0-WKUP) 11(PA1) 14(PA4) 15(PA5) 16(PA6) 18(PB0) 19(PB1) 25(PB12) 26(PB13) 33(PA12) 38(PA15/JTDI) 39(PB3/JTDO) 40(PB4/JNTRST) 41(PB5); U15 9(QH')*; Y1 2(GROUND) 4(GROUND)

## Notes on the sheet
- 串口热敏打印机接口
- (near P24) 与PC接口
- (near P17) SWD接口
- (near R11) 外部时钟
- 控制第3，4单列8个灯控板电源
- (near P18) ISP接口
- 蜂鸣器
- (near C4) 打印机电源
- (near U5) 控制第1，2单列8个灯控板电源
- (near U15) 控制第5，6单列8个灯控板电源
- 电源指示灯
- (near C26) 复位电路

## Library data of the parts
C2 C7 = Cap Pol1: Polarized Capacitor (Radial); Published: 8-Jun-2000; LatestRevisionDate: 17-Jul-2002; LatestRevisionNote: Re-released for DXP Platform.; PackageReference: RB7.6-15; Publisher: Altium Limited; PackageDescription: Polarized Capacitor (Radial); 2 Leads
  C2: Value: 100uF/50V
  C7: Value: 100uF/10V
C3-C6 C8-C10 C15 C16 C21-C27 C30 C41-C43 = Cap: Capacitor; Published: 8-Jun-2000; LatestRevisionDate: 17-Jul-2002; LatestRevisionNote: Re-released for DXP Platform.; PackageReference: RAD-0.3; Publisher: Altium Limited; PackageDescription: Radial Cap, Thru-Hole; 2 Leads; 0.3 in Pin Spacing
  C3: Value: 10uF/25V
  C4 C8-C10 C23 C26 C27 C41-C43: Value: 100nF
  C5 C15: Value: 10uF/10V
  C6 C16 C21 C22 C30: Value: 10uF
  C24 C25: Value: 20pF
C38 C39 C48-C52 = Capacitor: 电容器; 型号及规格: 0805-104K  (50V0.1μF±10%); 名称: 多层片状陶瓷电容; 封装: 0805; 供应商: 平尚科技
C53 = Cap Pol1: Polarized Capacitor (Radial); Value: 820uF/6.3V; Published: 8-Jun-2000; LatestRevisionDate: 17-Jul-2002; LatestRevisionNote: Re-released for DXP Platform.; PackageReference: RB7.6-15; Publisher: Altium Limited; PackageDescription: Polarized Capacitor (Radial); 2 Leads
D1 D4 D5 = Diode 1N4001: 1 Amp General Purpose Rectifier; Published: 8-Jun-2000; LatestRevisionDate: 17-Jul-2002; LatestRevisionNote: Re-released for DXP Platform.; DatasheetVersion: 1998; PackageVersion: Aug-1999; PackageReference: DO-41; Publisher: Altium Limited; PackageDescription: Diode, Axial; Body 5.2 x 2.7 mm (LxDia. max), Lead Dia. 0.86 mm (max); Code_JEDEC: DO-204-AL; ComponentLink1Description: Manufacturer Link; ComponentLink1URL: http://www.fairchildsemi.com/; ComponentLink2Description: Datasheet; ComponentLink2URL: http://www.fairchildsemi.com/ds/1N%2F1N4001.pdf
  D1: Value: SS34
  D4 D5: Value: SS14
D8 = Diode: 通用二极管; Published: 8-Jun-2000; LatestRevisionDate: 17-Jul-2002; LatestRevisionNote: Re-released for DXP Platform.; PackageVersion: Sep-1996; PackageReference: SMC; Publisher: Altium Limited; PackageDescription: DO-214-AB/SMC; 2 C-Bend Leads; Body 7.9 x 5.9 mm, inc. leads (LxW); Code_JEDEC: DO-214-AB
F1 = Fuse 2: Fuse; Published: 8-Jun-2000; LatestRevisionDate: 17-Jul-2002; LatestRevisionNote: Re-released for DXP Platform.; PackageReference: PIN-W2/E2.8; Publisher: Altium Limited; PackageDescription: Thru-Hole; 2 Leads
J1 = D Connector 9: Receptacle Assembly, 9 Position, Right Angle; PackageDocument: O; Positions: 9; Published: 15-Jun-2001; LatestRevisionDate: 17-Jul-2002; LatestRevisionNote: Re-released for DXP Platform.; DatasheetDocument: 1-Sep-1999; PackageReference: 788750; Publisher: Altium Limited; Orientation: Right Angle; Gender: Receptacle
L1 L2 L4 = Inductor: Code_IEC: 1005; Published: 8-Jun-2000; LatestRevisionDate: 29-May-2009; LatestRevisionNote: IPC-7351 Footprint Added.; PackageReference: 0402-A; Publisher: Altium Limited; PackageDescription: Chip Inductor; Code_JEITA: 0402
  L1 L2: Value: HCB2012KF-301T30
LD0 = LED0: LED灯; Published: 8-Jun-2000; LatestRevisionDate: 08-Jul-2005; LatestRevisionNote: Mech Layer 1 removed.; PackageReference: LED-0; Publisher: Altium Limited; Value: GREEN
LS1 = Buzzer: Magnetic Transducer Buzzer; Published: 24-Mar-1999; LatestRevisionDate: 17-Dec-2003; LatestRevisionNote: Schematic revised, PCB Footprint replaced.; DatasheetVersion: 17-Dec-2003; PackageReference: ABSM-1574; Publisher: Altium Limited; PackageDescription: Magnetic Transducer Buzzer; ComponentLink1Description: Manufacturer Link; ComponentLink1URL: http://www.megastar.com/linecard/buzzmode/index.php
P0 = Header 2: Header, 2-Pin; LatestRevisionDate: 17-Jul-2002; LatestRevisionNote: Re-released for DXP Platform.; Publisher: Altium Limited
P1_C1-P1_C6 P2_C1-P2_C6 P3_C1-P3_C6 P4_C1-P4_C6 = Header 6: Header, 6-Pin; LatestRevisionDate: 17-Jul-2002; LatestRevisionNote: Re-released for DXP Platform.; Publisher: Altium Limited
P17 P18 P24 = Header 4: Header, 4-Pin; LatestRevisionDate: 17-Jul-2002; LatestRevisionNote: Re-released for DXP Platform.; Publisher: Altium Limited
P23 = Header 5: Header, 5-Pin; LatestRevisionDate: 17-Jul-2002; LatestRevisionNote: Re-released for DXP Platform.; Publisher: Altium Limited
Q7 = MY_NPN: 8050/BCW846/BCW847
R1-R3 R5 R9 R11 R12 R14 R15 R17-R21 R29-R34 R36 R37 R40 R41 R52-R57 R61-R69 R71-R76 = Res2: Resistor; Published: 8-Jun-2000; LatestRevisionDate: 17-Jul-2002; LatestRevisionNote: Re-released for DXP Platform.; PackageReference: AXIAL-0.4; Publisher: Altium Limited
  R1 R2 R5 R9: PackageDescription: Axial Device, Thru-Hole; 2 Leads; 0.4 in Pin Spacing; Value: 100R
  R3 R12 R14 R17 R40 R41: PackageDescription: Axial Device, Thru-Hole; 2 Leads; 0.4 in Pin Spacing; Value: 10k
  R11: PackageDescription: Axial Device, Thru-Hole; 2 Leads; 0.4 in Pin Spacing; Value: 1M
  R15: PackageDescription: Axial Device, Thru-Hole; 2 Leads; 0.4 in Pin Spacing; Value: 0
  R18 R19: PackageDescription: Axial Device, Thru-Hole; 2 Leads; 0.4 in Pin Spacing; Value: 100
  R20 R21: Value: 2k
  R29-R34 R52-R57 R61-R66 R71-R76: PackageDescription: Axial Device, Thru-Hole; 2 Leads; 0.4 in Pin Spacing; Value: 20K
  R36 R37: PackageDescription: Axial Device, Thru-Hole; 2 Leads; 0.4 in Pin Spacing; Value: 1k
  R67-R69: PackageDescription: Axial Device, Thru-Hole; 2 Leads; 0.4 in Pin Spacing; Value: 2k
R6-R8 R10 R43-R45 R47-R51 = Resistance: 电阻器; 型号及规格: 0805-000J(0kΩ±5%); 名称: 厚膜片式固定电阻; 封装: 0805; 供应商: 平尚科技
S0-S2 = SW-PB-4pin: Switch; Published: 24-Mar-1999; LatestRevisionDate: 17-Jul-2002; LatestRevisionNote: Re-released for DXP Platform.; PackageReference: SPST-2; Publisher: Altium Limited
  S1 S2: Value: K2-6639SP-C4SC-04
U2 = TD1519A
U3 = CESDLC5V0M5
U4 U16 = ME6208A50PG
U5 U14 U15 = 74HC595: Value: MC74HC595ADR2G
U6 = STM32F103C8T6: STM32 ARM-based 32-bit MCU with 64 Kbytes Flash, 48-pin LQFP, Industrial Temperature; Published: 30-May-2008; DatasheetVersion: rev6, Mar-2008; PackageVersion: Mar-2008; PackageReference: LQFP48; Publisher: Altium Limited; PackageDescription: 48-Pin Low-Profile Quad Flat Pack, 7 x 7 mm Body, 0.5 mm Pitch (LQFP48); ComponentLink1Description: Manufacturer Link; ComponentLink1URL: www.st.com/stm32; ComponentLink2Description: Datasheet; ComponentLink2URL: http://www.st.com/stonline/products/literature/ds/13587.pdf
Y1 = CRYSTAL-PASSIVE_3225
Z1 = D Zener: Zener Diode; Published: 8-Jun-2000; LatestRevisionDate: 17-Jul-2002; LatestRevisionNote: Re-released for DXP Platform.; PackageReference: DIODE-0.7; Publisher: Altium Limited; PackageDescription: Diode, Thru-Hole; 2 Leads; 0.7 in Pin Spacing